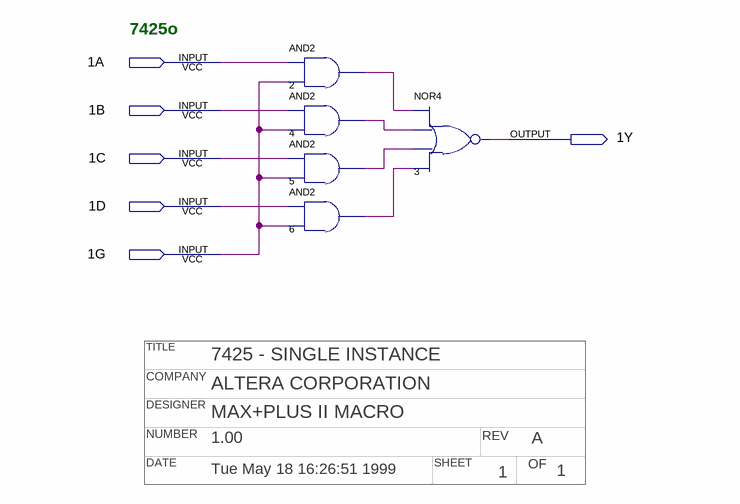
[diagram p0: schematic sheet]
// Quartus schematic 7425o.bdf as structural Verilog: 5 symbols, 6 pins
// Title block: TITLE: 7425 - SINGLE INSTANCE; COMPANY: ALTERA CORPORATION; DESIGNER: MAX+PLUS II MACRO; NUMBER: 1.00; REV: A; DATE: Tue May 18 16:26:51 1999; SHEET: 1; OF: 1
module \7425o  (
  input  \1A ,
  input  \1B ,
  input  \1C ,
  input  \1D ,
  input  \1G ,
  output \1Y 
);

  wire n2_out, n4_out, n5_out, n6_out;

  and u_2 (n2_out, \1A , \1G );
  and u_4 (n4_out, \1B , \1G );
  and u_5 (n5_out, \1C , \1G );
  and u_6 (n6_out, \1D , \1G );
  nor u_3 (\1Y , n2_out, n4_out, n5_out, n6_out);

  // Notes on the sheet:
  //   7425o
endmodule
